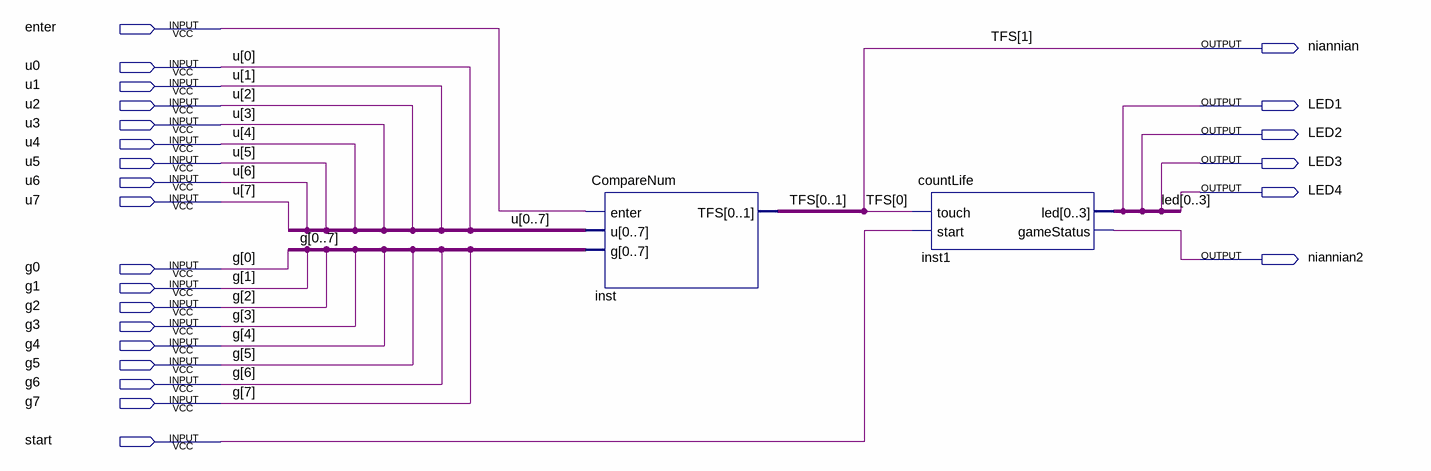
[diagram p0: schematic sheet]
// Quartus schematic CompareCount.bdf as structural Verilog: 2 symbols, 24 pins
module CompareCount (
  input  enter,
  input  u0,
  input  u1,
  input  u2,
  input  u3,
  input  u4,
  input  u5,
  input  u6,
  input  u7,
  input  g0,
  input  g1,
  input  g2,
  input  g3,
  input  g4,
  input  g5,
  input  g6,
  input  g7,
  input  start,
  output niannian,
  output LED1,
  output LED2,
  output LED3,
  output LED4,
  output niannian2
);

  wire [0:0] led, TFS;

  CompareNum inst (
    .enter(enter), .u({u0, u1, u2, u3, u4, u5, u6, u7}), .g({g0, g1, g2, g3, g4, g5, g6, g7}),
    .TFS({TFS[0], niannian}));
  countLife inst1 (.touch(TFS[0]), .start(start), .led({led[0], LED1, LED2, LED3}), .gameStatus(niannian2));

  // Other names for the same wires on the sheet: TFS[1] = niannian
endmodule
